# Altium schematic sheet [09]USBHub.SchDoc
size A4
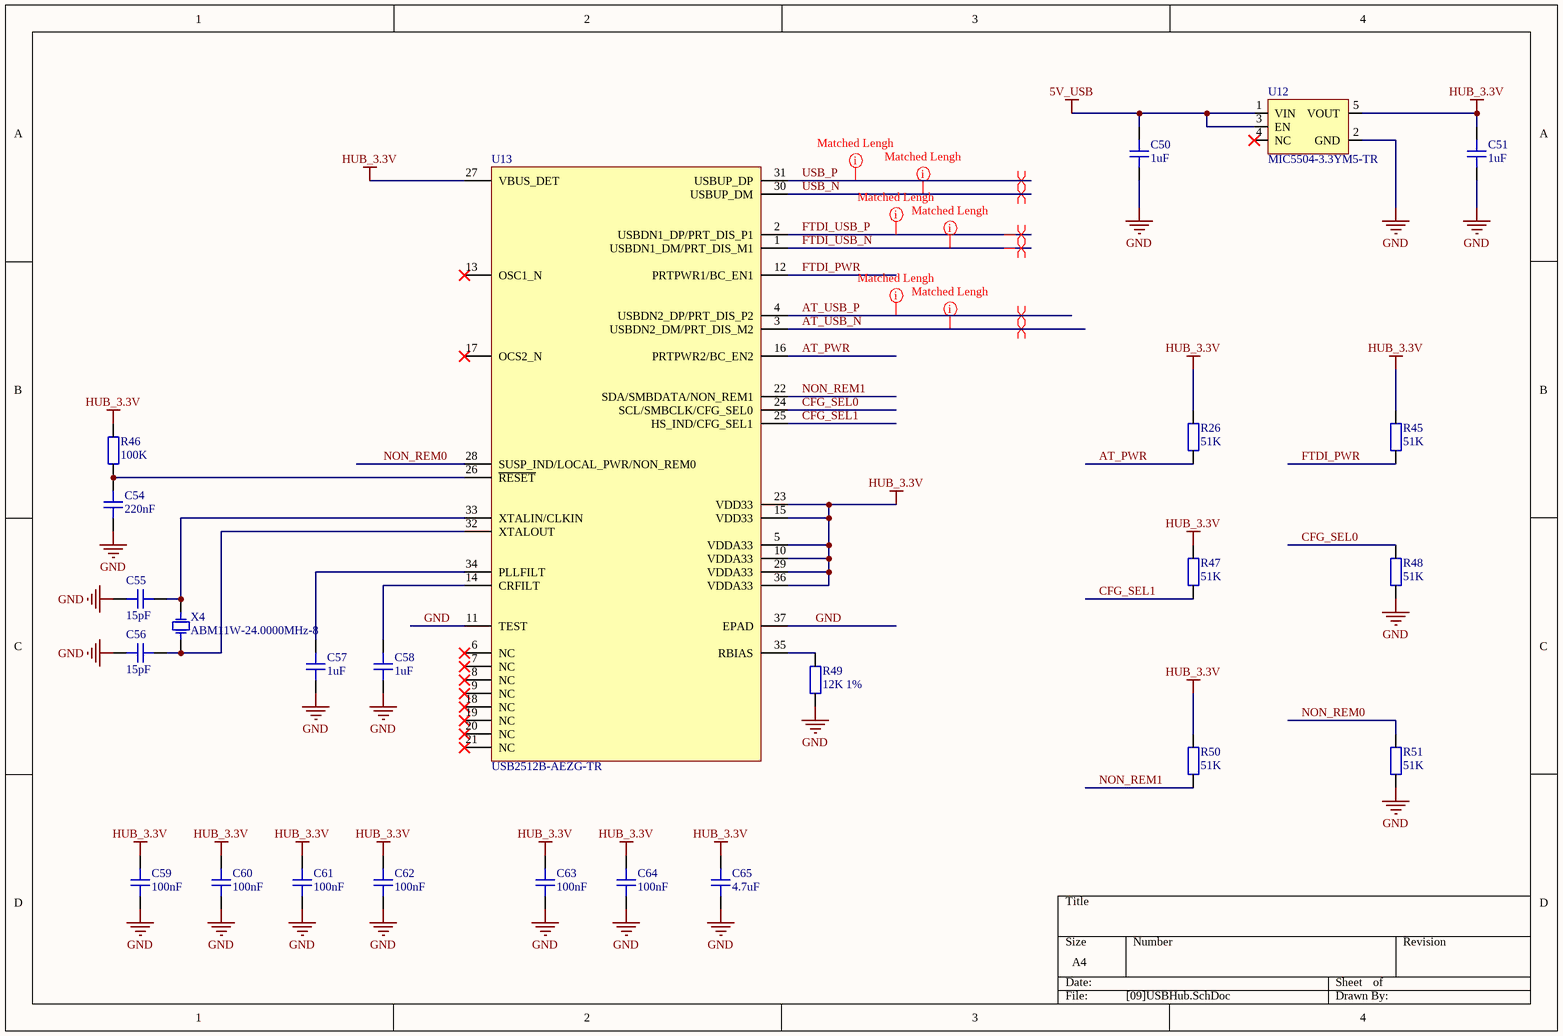
[diagram p0: [09]USBHub.SchDoc]

## Parts
C50  1uF  [CAPC1005L]
C51  1uF  [CAPC1005L]
C54  220nF  [CAPC1005L]
C55  15pF  [CAPC1005L]
C56  15pF  [CAPC1005L]
C57  1uF  [CAPC1005L]
C58  1uF  [CAPC1005L]
C59  100nF  [CAPC1005L]
C60  100nF  [CAPC1005L]
C61  100nF  [CAPC1005L]
C62  100nF  [CAPC1005L]
C63  100nF  [CAPC1005L]
C64  100nF  [CAPC1005L]
C65  4.7uF  [CAPC1005L]
R26  51K  [RESC1005L]
R45  51K  [RESC1005L]
R46  100K  [RESC1005L]
R47  51K  [RESC1005L]
R48  51K  [RESC1005L]
R49  12K 1%  [RESC1005L]
R50  51K  [RESC1005L]
R51  51K  [RESC1005L]
U12  MIC5504-3.3YM5-TR  [SOT23-5_L]
U13  USB2512B-AEZG-TR  [QFN50P600X600-36V4L]
X4  ABM11W-24.0000MHz-8  [OSCCC160X200X100]

## Nets
5V_USB: C50.2 U12.1(VIN) U12.3(EN)
GND: C50.1 C51.1 C54.1 C55.2 C56.2 C57.1 C58.1 C59.1 C60.1 C61.1 C62.1 C63.1 C64.1 C65.1 R48.1 R49.1 R51.1 U12.2(GND) U13.11(TEST) U13.37(EPAD) X4.2 X4.4
HUB_3.3V: C51.2 C59.2 C60.2 C61.2 C62.2 C63.2 C64.2 C65.2 R26.2 R45.2 R46.2 R47.2 R50.2 U12.5(VOUT) U13.5(VDDA33) U13.10(VDDA33) U13.15(VDD33) U13.23(VDD33) U13.27(VBUS_DET) U13.29(VDDA33) U13.36(VDDA33)
AT_PWR: R26.1 U13.16(PRTPWR2/BC_EN2)
AT_USB_N: U13.3(USBDN2_DM/PRT_DIS_M2)
AT_USB_P: U13.4(USBDN2_DP/PRT_DIS_P2)
CFG_SEL0: R48.2 U13.24(SCL/SMBCLK/CFG_SEL0)
CFG_SEL1: R47.1 U13.25(HS_IND/CFG_SEL1)
FTDI_PWR: R45.1 U13.12(PRTPWR1/BC_EN1)
FTDI_USB_N: U13.1(USBDN1_DM/PRT_DIS_M1)
FTDI_USB_P: U13.2(USBDN1_DP/PRT_DIS_P1)
NON_REM0: R51.2 U13.28(SUSP_IND/LOCAL_PWR/NON_REM0)
NON_REM1: R50.1 U13.22(SDA/SMBDATA/NON_REM1)
USB_N: U13.30(USBUP_DM)
USB_P: U13.31(USBUP_DP)
NetC54_2: C54.2 R46.1 U13.26(~{RESET})
NetC55_1: C55.1 U13.33(XTALIN/CLKIN) X4.3
NetC56_1: C56.1 U13.32(XTALOUT) X4.1
NetC57_2: C57.2 U13.34(PLLFILT)
NetC58_2: C58.2 U13.14(CRFILT)
NetR49_2: R49.2 U13.35(RBIAS)

Not connected (* = marked no-connect by the designer): U12 4(NC)*; U13 6(NC)* 7(NC)* 8(NC)* 9(NC)* 13(OSC1_N)* 17(OCS2_N)* 18(NC)* 19(NC)* 20(NC)* 21(NC)*

## Layout directives
differential pair: AT_USB_N, AT_USB_P, FTDI_USB_N, FTDI_USB_P, USB_N, USB_P
rule Matched Net Lengths [Tolerance = 50mil]: AT_USB_N, AT_USB_P, FTDI_USB_N, FTDI_USB_P, USB_N, USB_P

## Library data of the parts
C50 C51 C54-C65 = CAP_CHP: Surface Mount Unpolarized Capacitor
R26 R45-R51 = RES_CHP: Surface Mount Resistor
U12 = MIC5504-3.3YM5-TR: Linear Voltage Regulator Positive Fixed 1 Output 3.3V 300mA SOT-23-5
U13 = USB2512B: USB 2.0 High-Speed 2-Port Hub Controller
X4 = XTAL_SMD_4PIN: Surface Mount Crystal